# Altium schematic sheet Processor.SchDoc
size A3
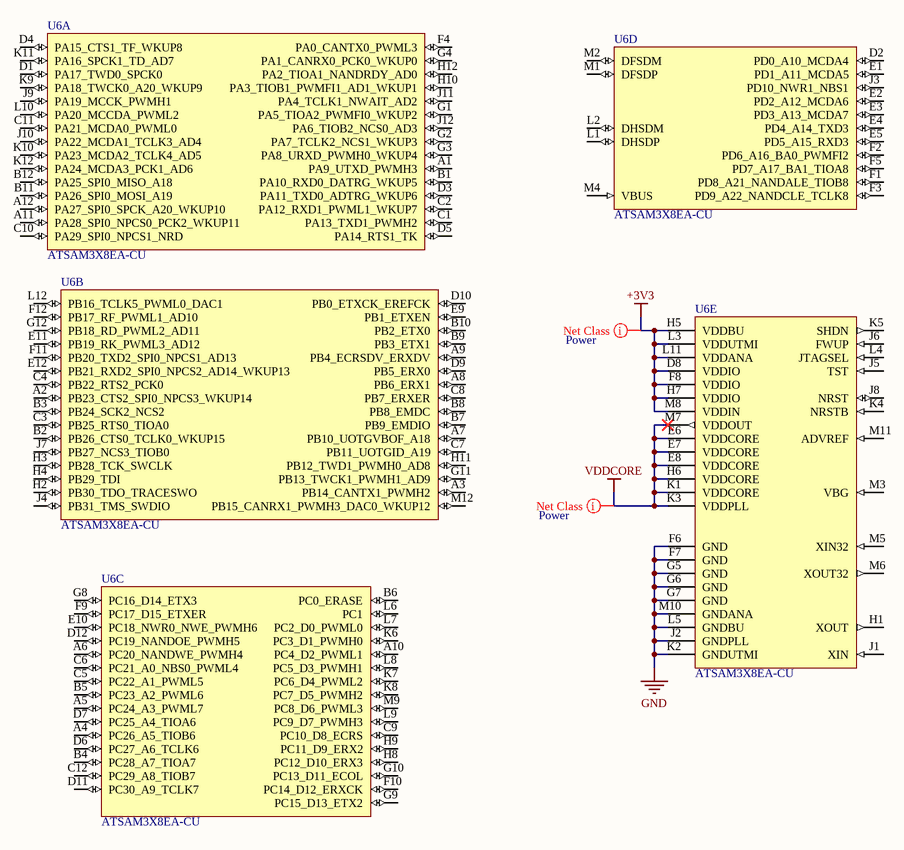
[diagram p0: Processor.SchDoc]

## Parts
U6  ATSAM3X8EA-CU  [Atmel_LFBGA144_M]  (parts A,B,C,D,E of 5)

## Nets
+3V3: U6.D8(VDDIO) U6.F8(VDDIO) U6.H5(VDDBU) U6.H7(VDDIO) U6.L3(VDDUTMI) U6.L11(VDDANA) U6.M8(VDDIN)
GND: U6.F6(GND) U6.F7(GND) U6.G5(GND) U6.G6(GND) U6.G7(GND) U6.J2(GNDPLL) U6.K2(GNDUTMI) U6.L5(GNDBU) U6.M10(GNDANA)
VDDCORE: U6.E6(VDDCORE) U6.E7(VDDCORE) U6.E8(VDDCORE) U6.H6(VDDCORE) U6.K1(VDDCORE) U6.K3(VDDPLL) U6.M7(VDDOUT)

Not connected (* = marked no-connect by the designer): U6 A1(PA9_UTXD_PWMH3) A2(PB23_CTS2_SPI0_NPCS3_WKUP14) A3(PB14_CANTX1_PWMH2) A4(PC26_A5_TIOB6) A5(PC24_A3_PWML7) A6(PC20_NANDWE_PWMH4) A7(PB10_UOTGVBOF_A18) A8(PB6_ERX1) A9(PB4_ECRSDV_ERXDV) A10(PC4_D2_PWML1) A11(PA28_SPI0_NPCS0_PCK2_WKUP11) A12(PA27_SPI0_SPCK_A20_WKUP10) B1(PA10_RXD0_DATRG_WKUP5) B2(PB26_CTS0_TCLK0_WKUP15) B3(PB24_SCK2_NCS2) B4(PC28_A7_TIOA7) B5(PC23_A2_PWML6) B6(PC0_ERASE) B7(PB9_EMDIO) B8(PB8_EMDC) B9(PB3_ETX1) B10(PB2_ETX0) B11(PA26_SPI0_MOSI_A19) B12(PA25_SPI0_MISO_A18) C1(PA13_TXD1_PWMH2) C2(PA12_RXD1_PWML1_WKUP7) C3(PB25_RTS0_TIOA0) C4(PB22_RTS2_PCK0) C5(PC22_A1_PWML5) C6(PC21_A0_NBS0_PWML4) C7(PB11_UOTGID_A19) C8(PB7_ERXER) C9(PC10_D8_ECRS) C10(PA29_SPI0_NPCS1_NRD) C11(PA21_MCDA0_PWML0) C12(PC29_A8_TIOB7) D1(PA17_TWD0_SPCK0) D2(PD0_A10_MCDA4) D3(PA11_TXD0_ADTRG_WKUP6) D4(PA15_CTS1_TF_WKUP8) D5(PA14_RTS1_TK) D6(PC27_A6_TCLK6) D7(PC25_A4_TIOA6) D9(PB5_ERX0) D10(PB0_ETXCK_EREFCK) D11(PC30_A9_TCLK7) D12(PC19_NANDOE_PWMH5) E1(PD1_A11_MCDA5) E2(PD2_A12_MCDA6) E3(PD3_A13_MCDA7) E4(PD4_A14_TXD3) E5(PD5_A15_RXD3) E9(PB1_ETXEN) E10(PC18_NWR0_NWE_PWMH6) E11(PB19_RK_PWML3_AD12) E12(PB21_RXD2_SPI0_NPCS2_AD14_WKUP13) F1(PD8_A21_NANDALE_TIOB8) F2(PD6_A16_BA0_PWMFI2) F3(PD9_A22_NANDCLE_TCLK8) F4(PA0_CANTX0_PWML3) F5(PD7_A17_BA1_TIOA8) F9(PC17_D15_ETXER) F10(PC14_D12_ERXCK) F11(PB20_TXD2_SPI0_NPCS1_AD13) F12(PB17_RF_PWML1_AD10) G1(PA5_TIOA2_PWMFI0_WKUP2) G2(PA7_TCLK2_NCS1_WKUP3) G3(PA8_URXD_PWMH0_WKUP4) G4(PA1_CANRX0_PCK0_WKUP0) G8(PC16_D14_ETX3) G9(PC15_D13_ETX2) G10(PC13_D11_ECOL) G11(PB13_TWCK1_PWMH1_AD9) G12(PB18_RD_PWML2_AD11) H1(XOUT) H2(PB30_TDO_TRACESWO) H3(PB28_TCK_SWCLK) H4(PB29_TDI) H8(PC12_D10_ERX3) H9(PC11_D9_ERX2) H10(PA3_TIOB1_PWMFI1_AD1_WKUP1) H11(PB12_TWD1_PWMH0_AD8) H12(PA2_TIOA1_NANDRDY_AD0) J1(XIN) J3(PD10_NWR1_NBS1) J4(PB31_TMS_SWDIO) J5(TST) J6(FWUP) J7(PB27_NCS3_TIOB0) J8(NRST) J9(PA19_MCCK_PWMH1) J10(PA22_MCDA1_TCLK3_AD4) J11(PA4_TCLK1_NWAIT_AD2) J12(PA6_TIOB2_NCS0_AD3) K4(NRSTB) K5(SHDN) K6(PC3_D1_PWMH0) K7(PC6_D4_PWML2) K8(PC7_D5_PWMH2) K9(PA18_TWCK0_A20_WKUP9) K10(PA23_MCDA2_TCLK4_AD5) K11(PA16_SPCK1_TD_AD7) K12(PA24_MCDA3_PCK1_AD6) L1(DHSDP) L2(DHSDM) L4(JTAGSEL) L6(PC1) L7(PC2_D0_PWML0) L8(PC5_D3_PWMH1) L9(PC9_D7_PWMH3) L10(PA20_MCCDA_PWML2) L12(PB16_TCLK5_PWML0_DAC1) M1(DFSDP) M2(DFSDM) M3(VBG) M4(VBUS) M5(XIN32) M6(XOUT32) M9(PC8_D6_PWML3) M11(ADVREF) M12(PB15_CANRX1_PWMH3_DAC0_WKUP12)

## Layout directives
net class Power: +3V3, VDDCORE